# EasyEDA schematic SCH_v0.6_2021-07-22.json

## Sheets
1 CPU CORE: TITLE: CPU Core; REV: 0.5; Date: 2021-04-05; Sheet: 2/4; Drawn By: Renee; Company: The Buffee Project
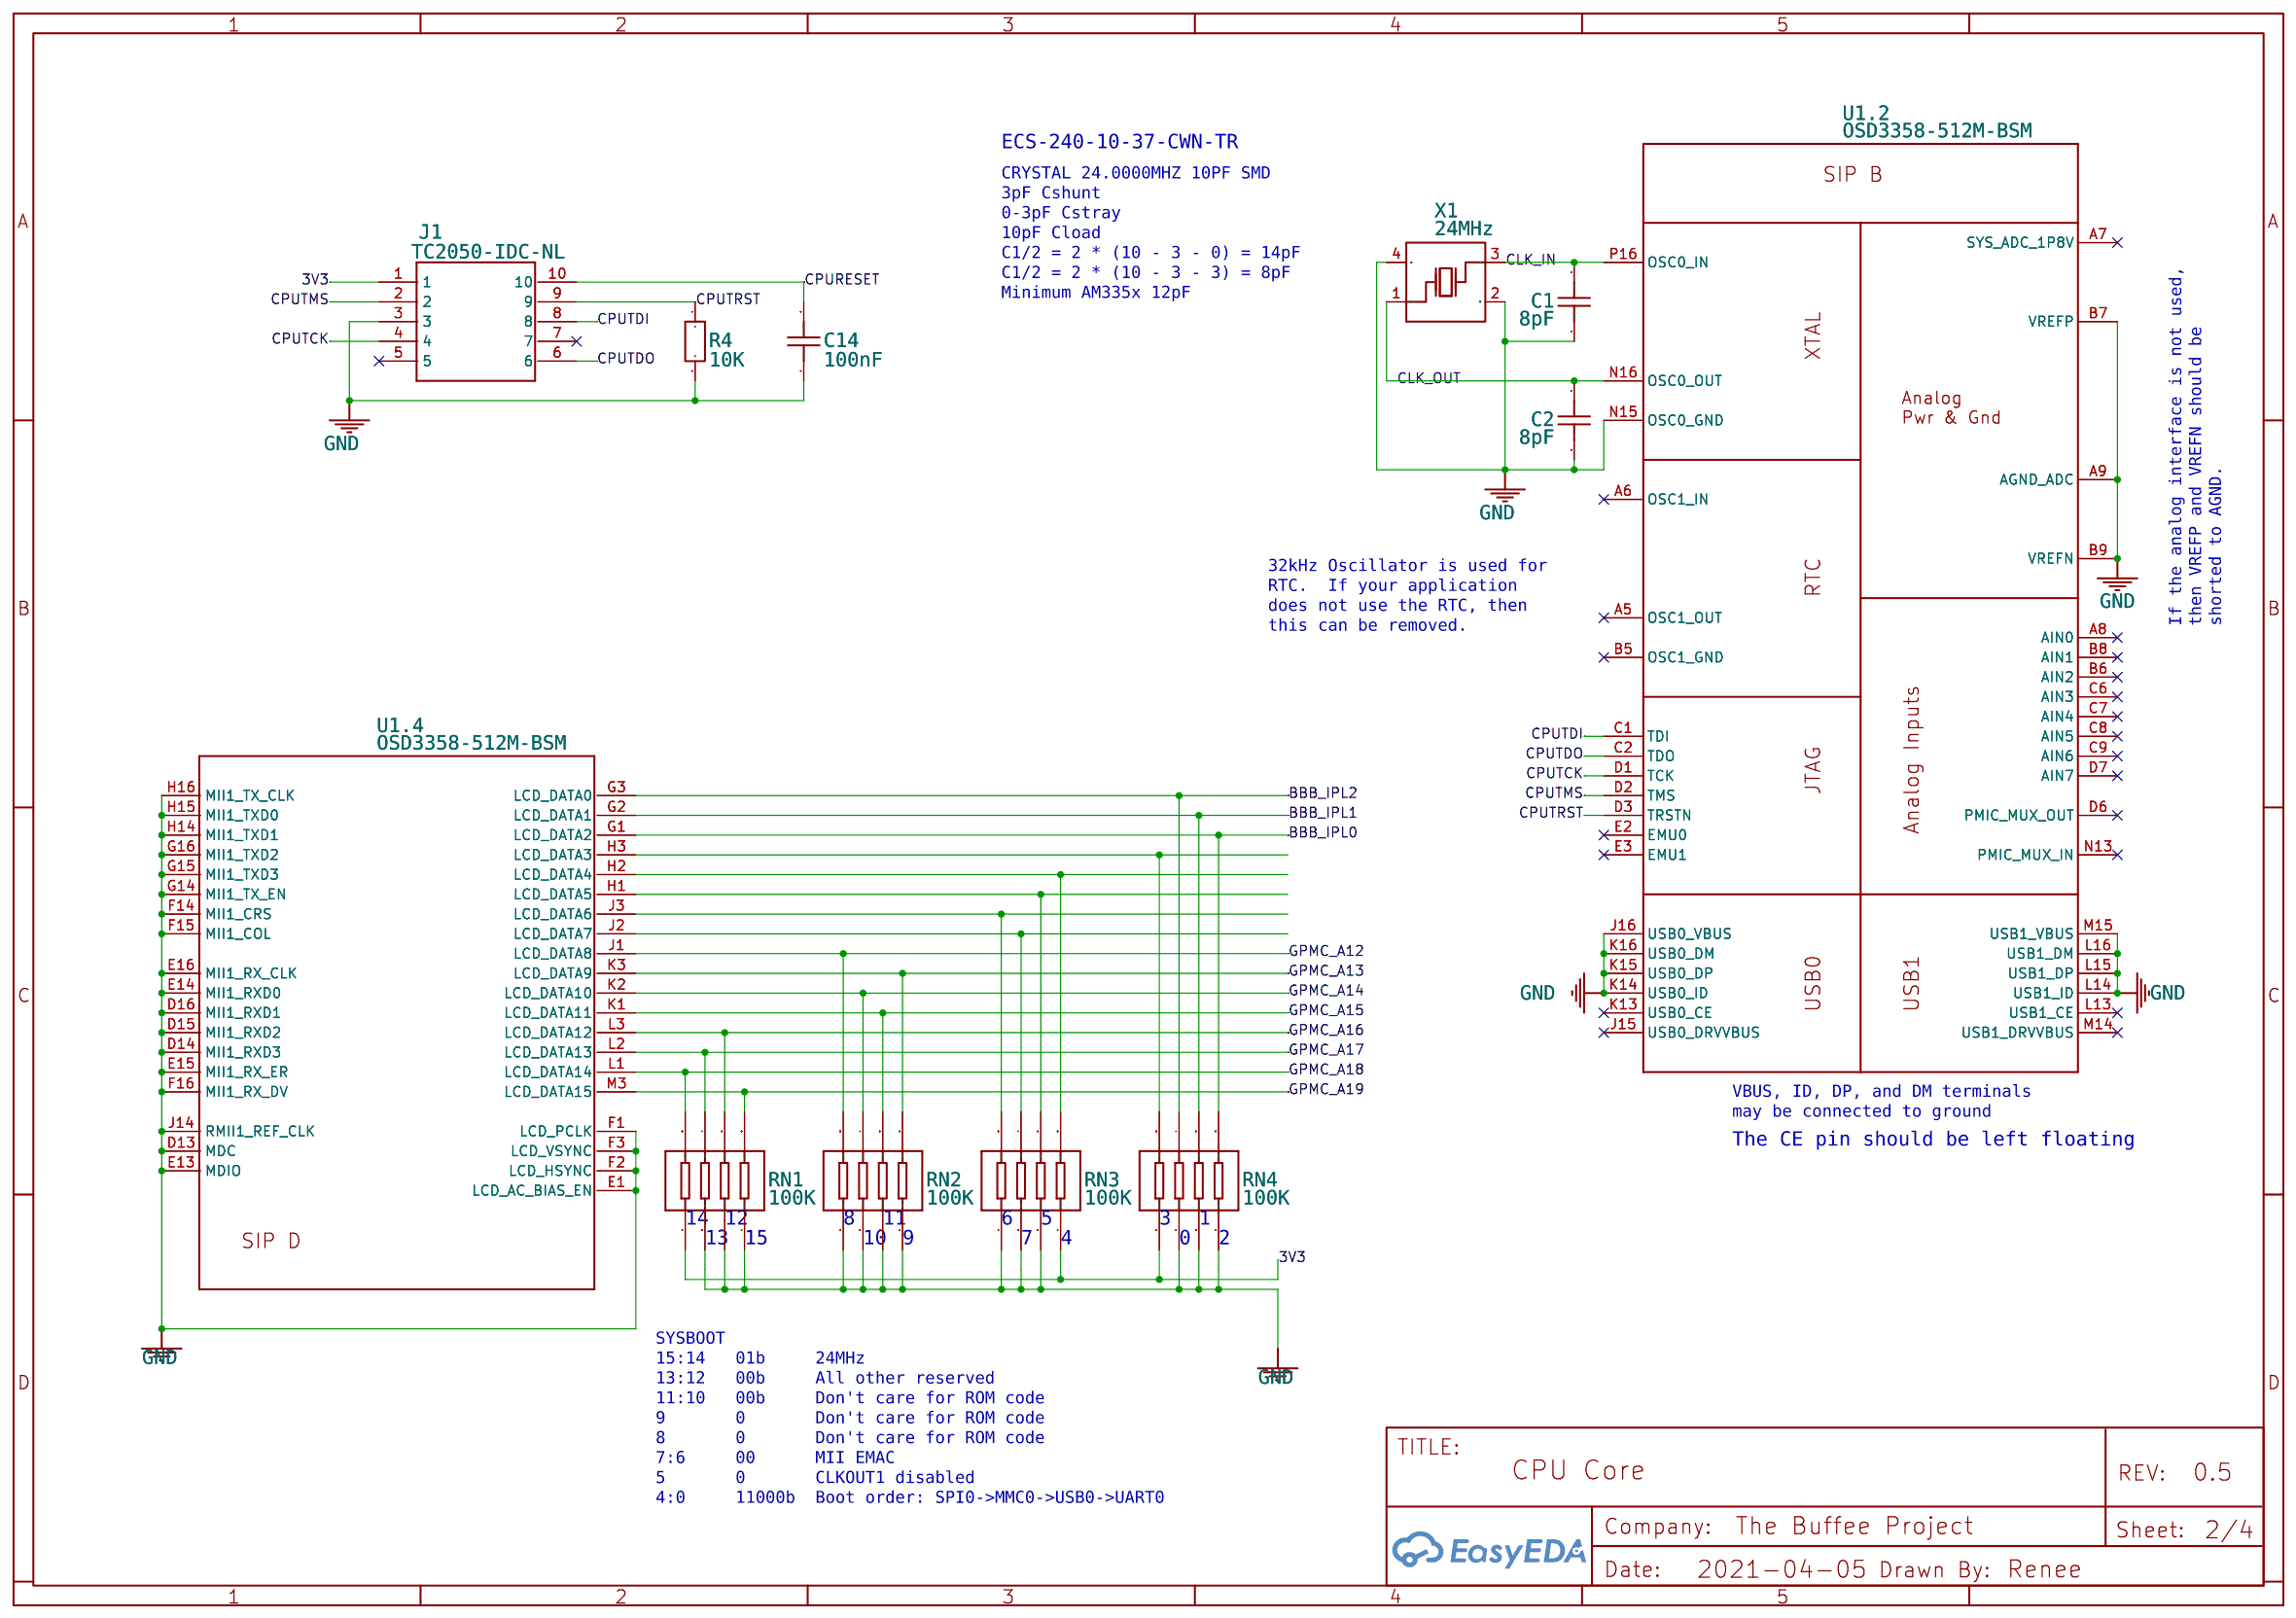
[diagram p0: CPU CORE]
2 CPU IO: TITLE: CPU Interface; Date: 2021-04-08; Sheet: 3/4
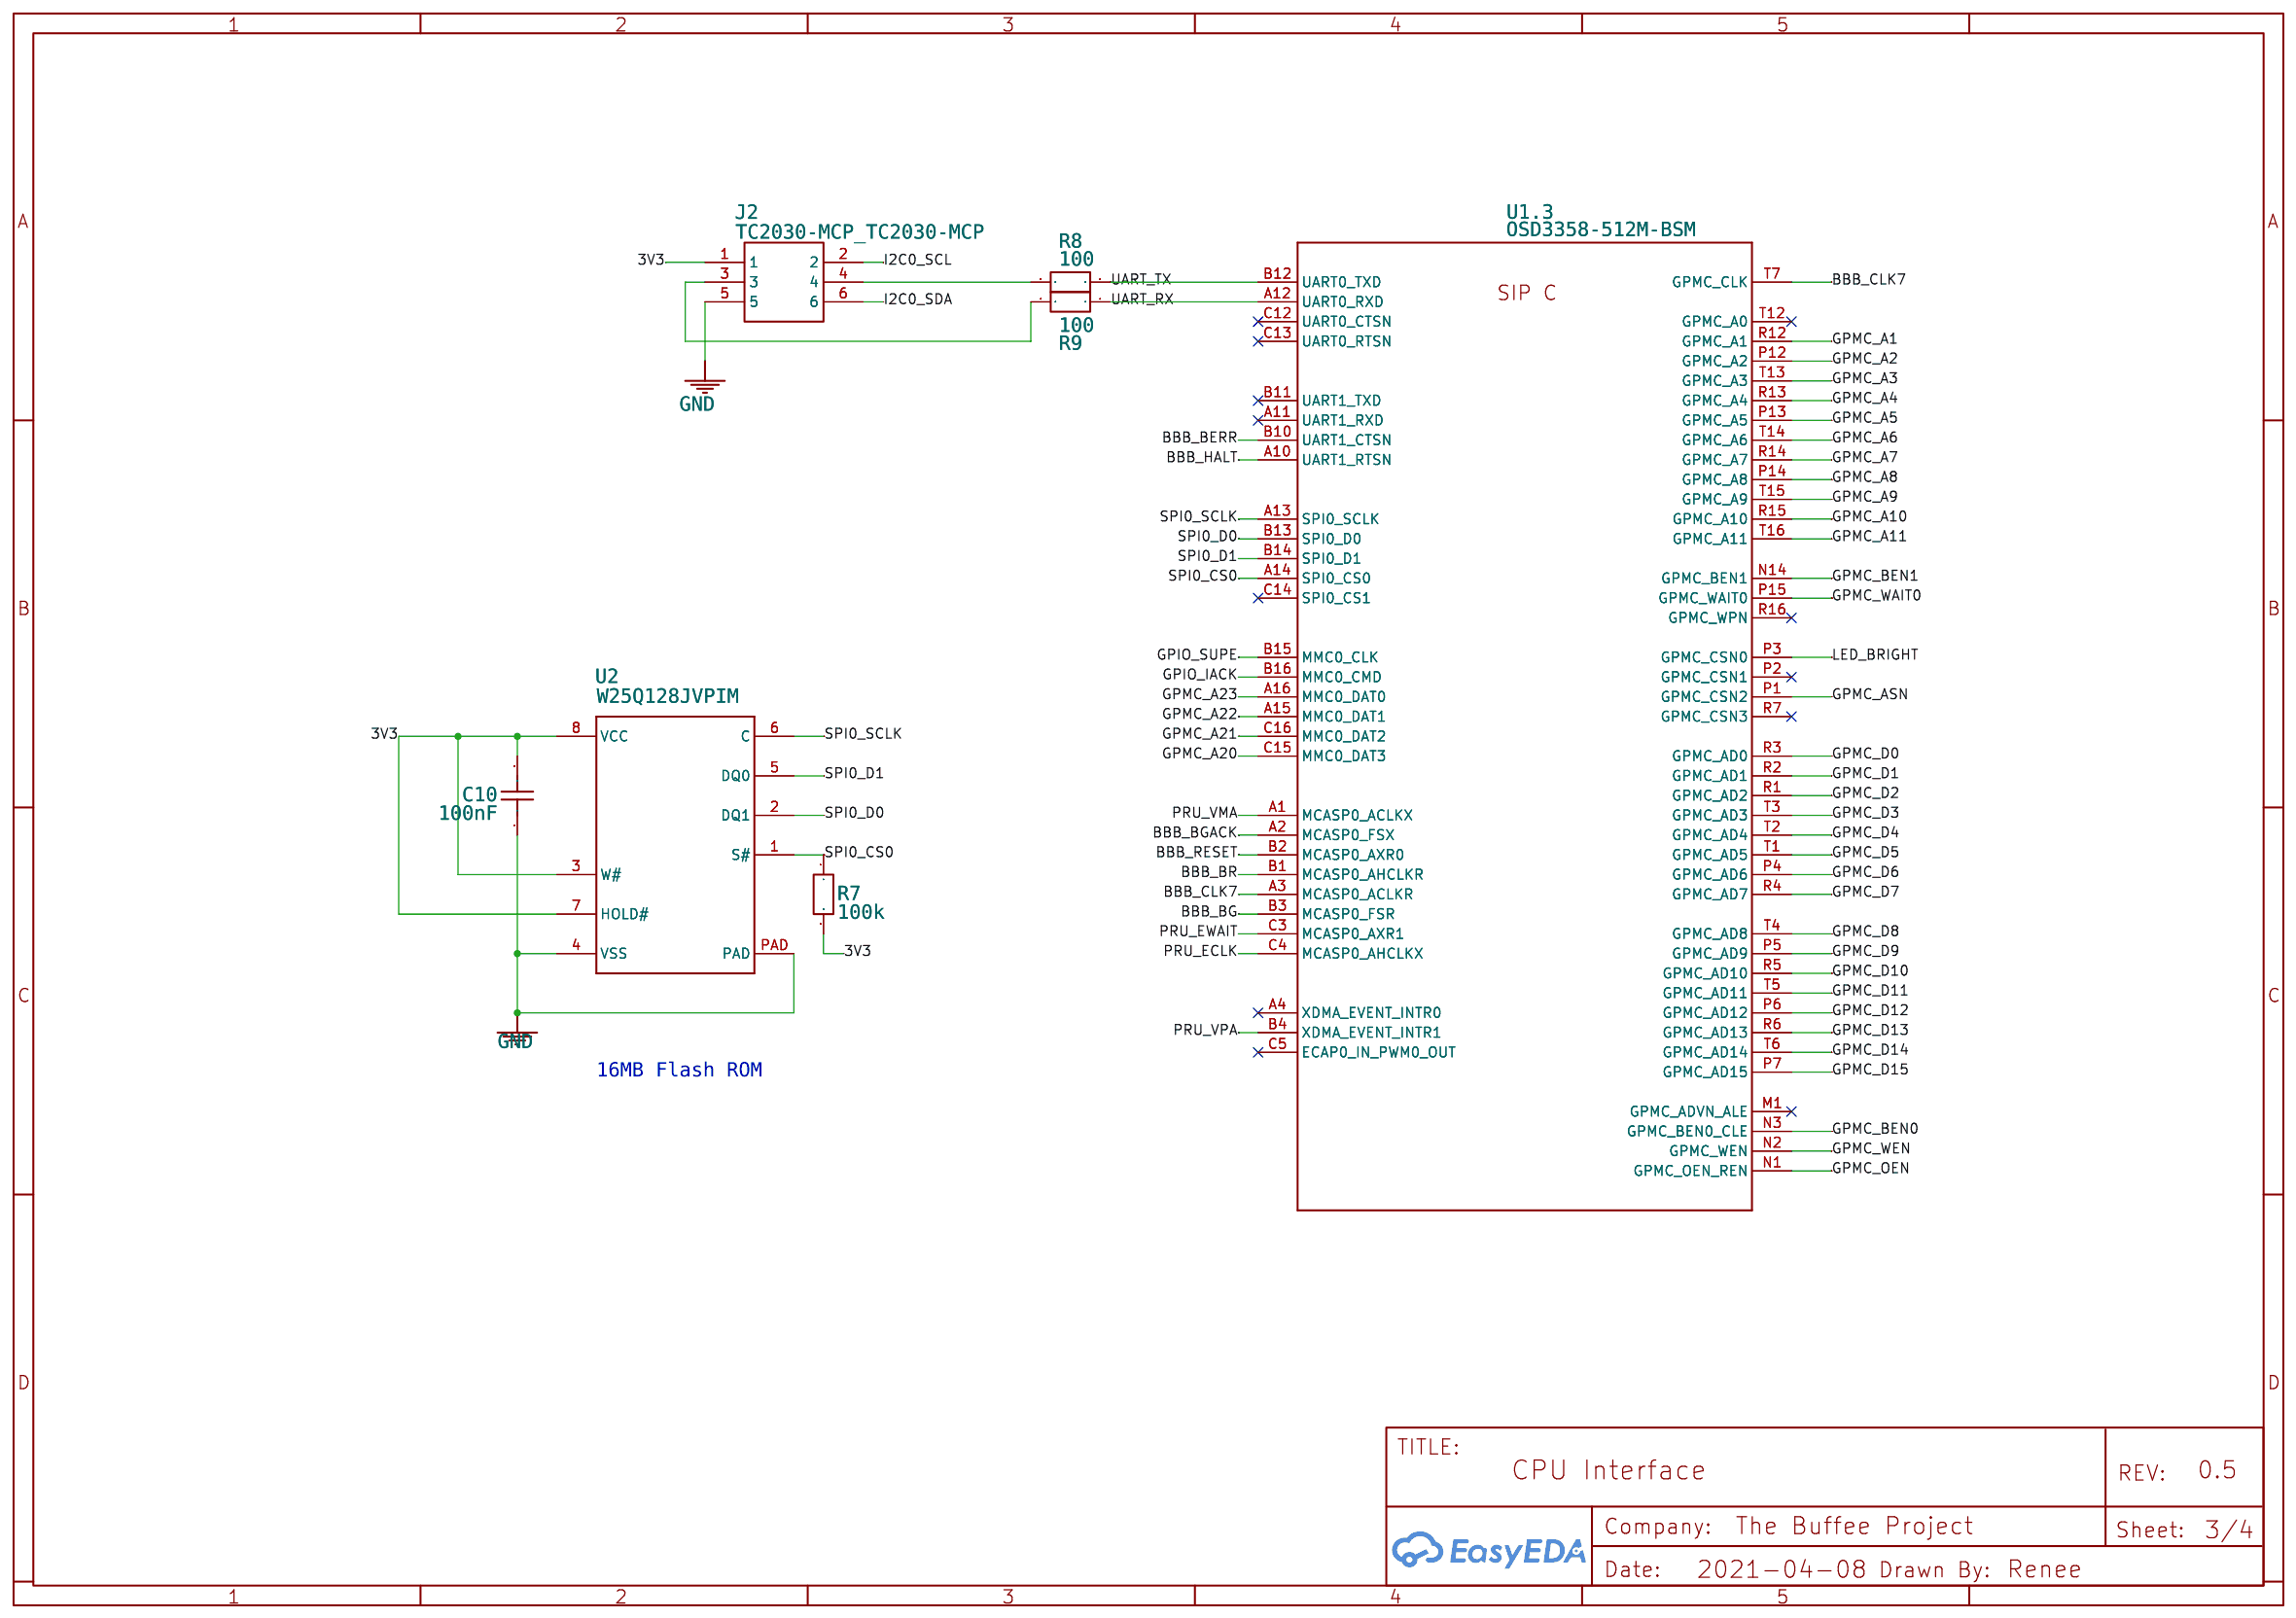
[diagram p1: CPU IO]
3 M68K IO: TITLE: M68K Interface; Date: 2021-04-08; Sheet: 4/4
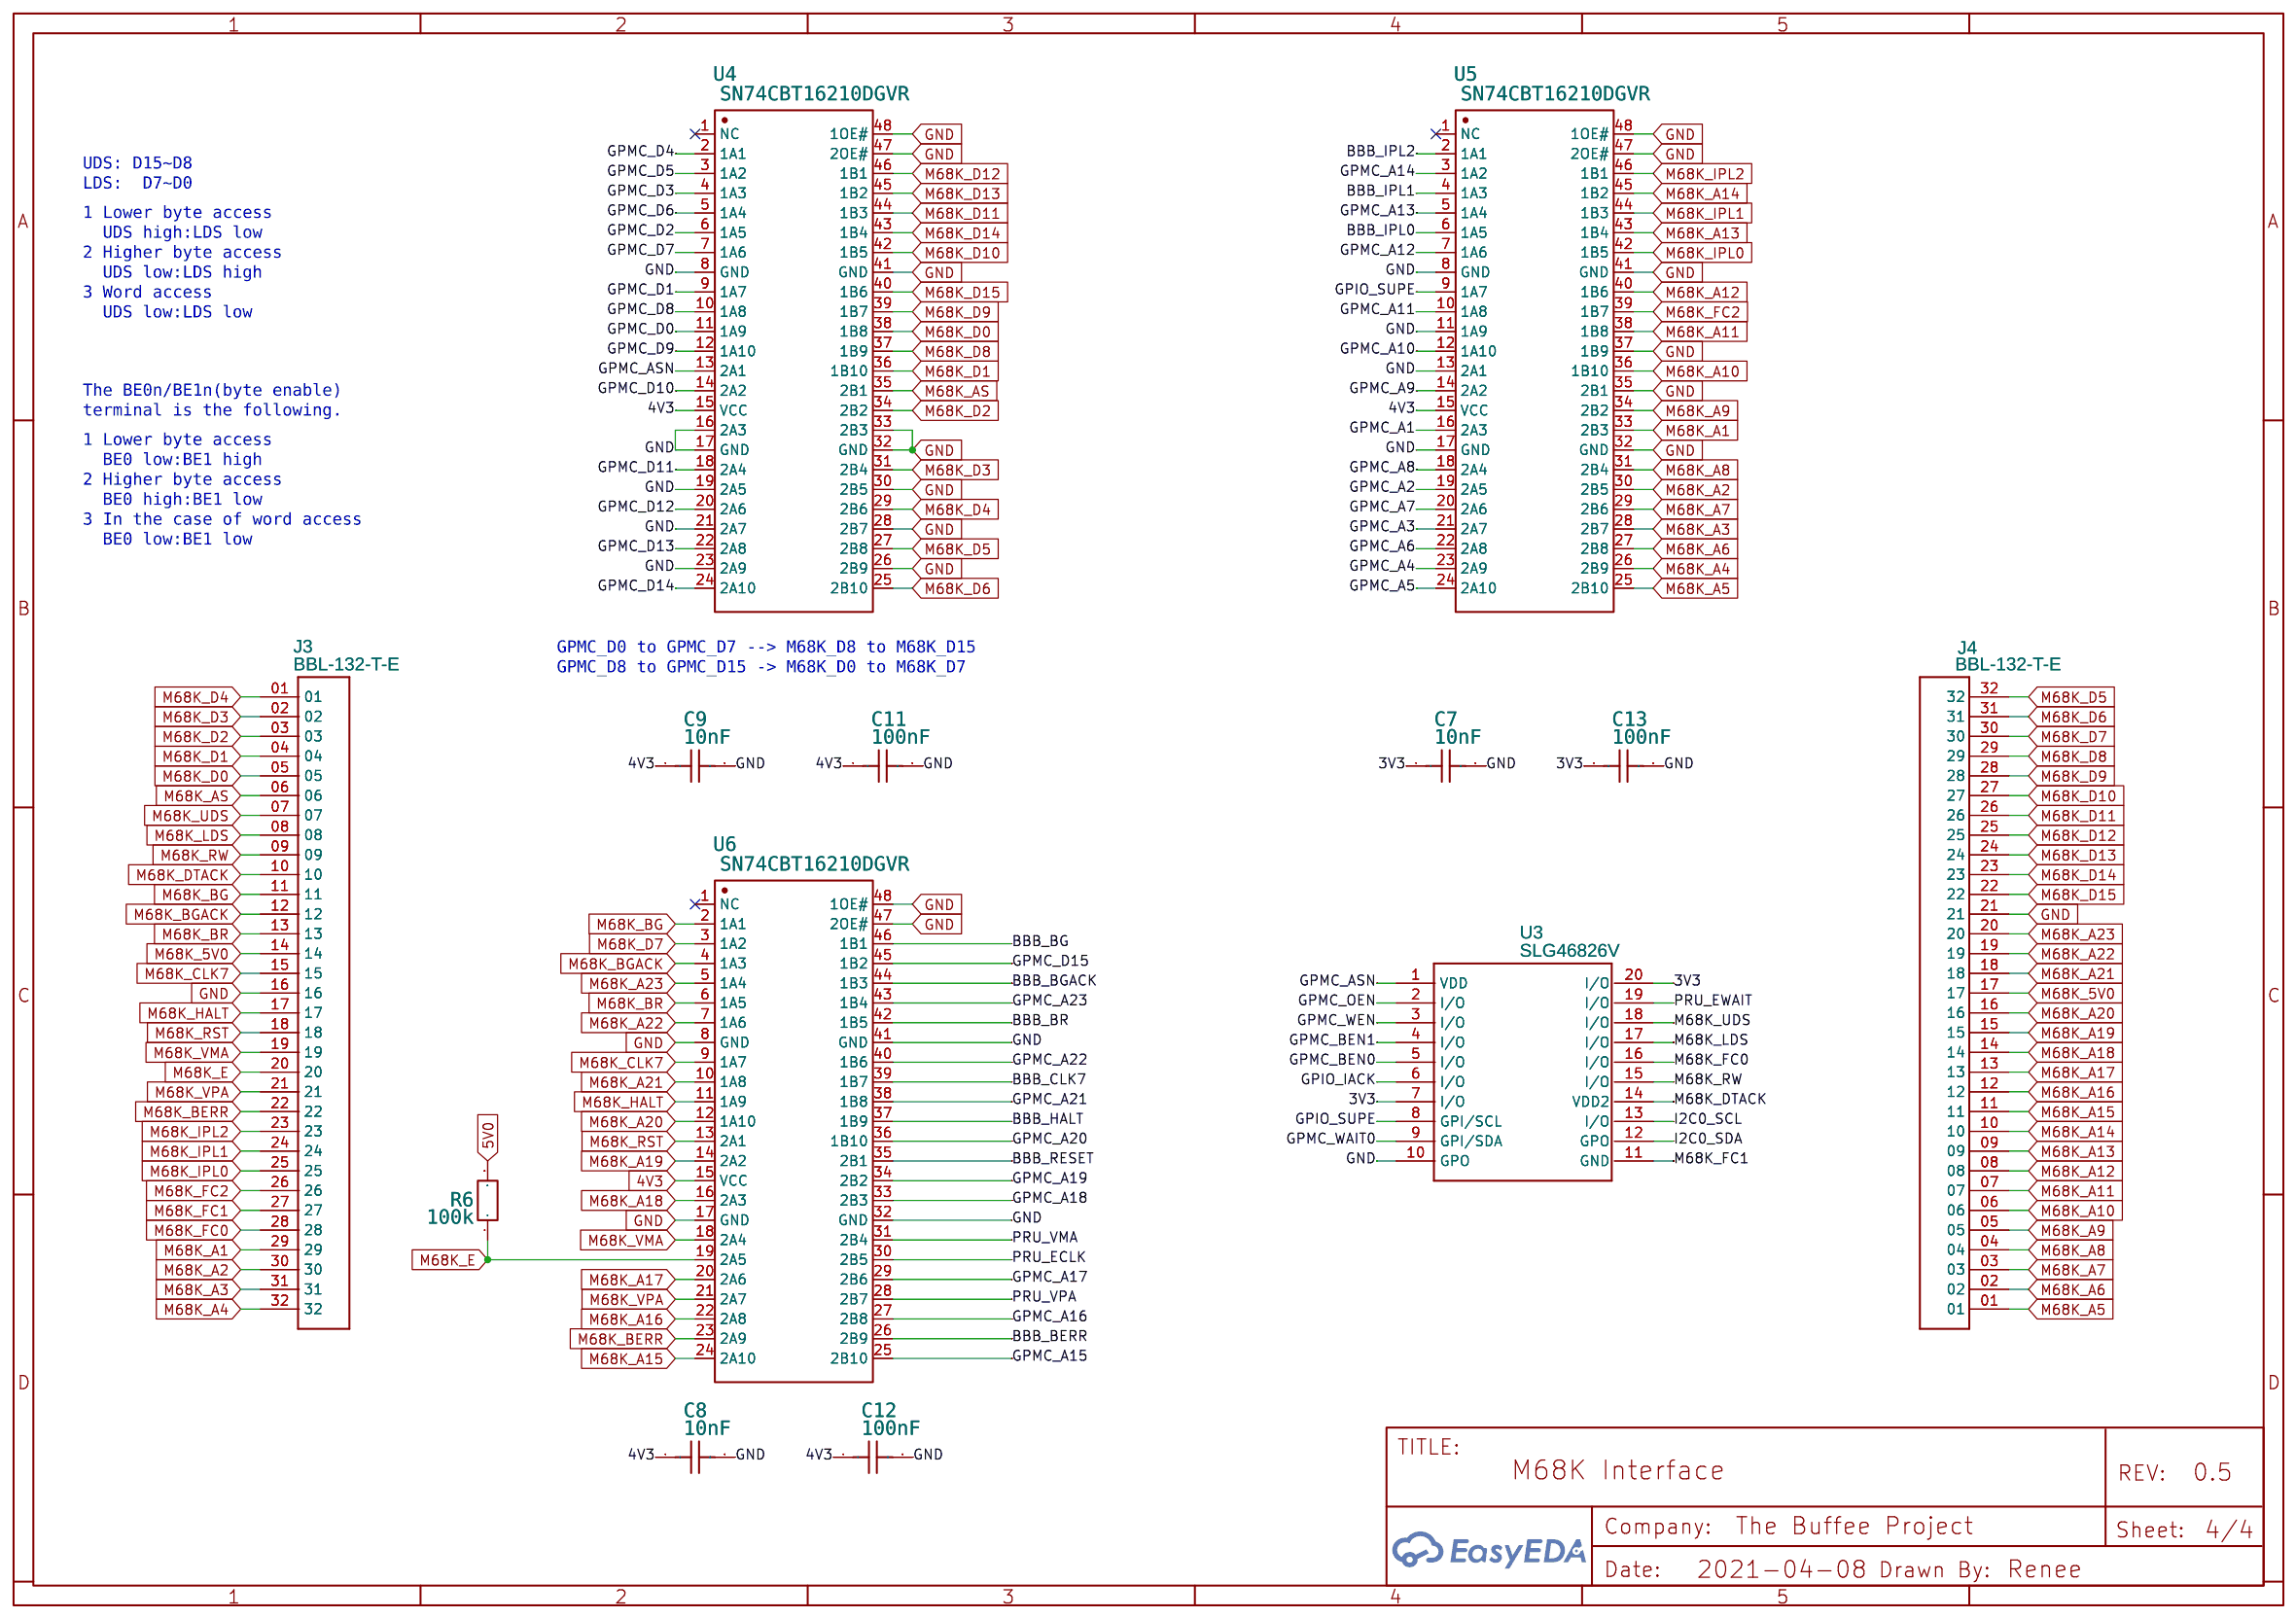
[diagram p2: M68K IO]
4 POWER: TITLE: CPU Power and LED; Date: 2021-04-08; Sheet: 1/4
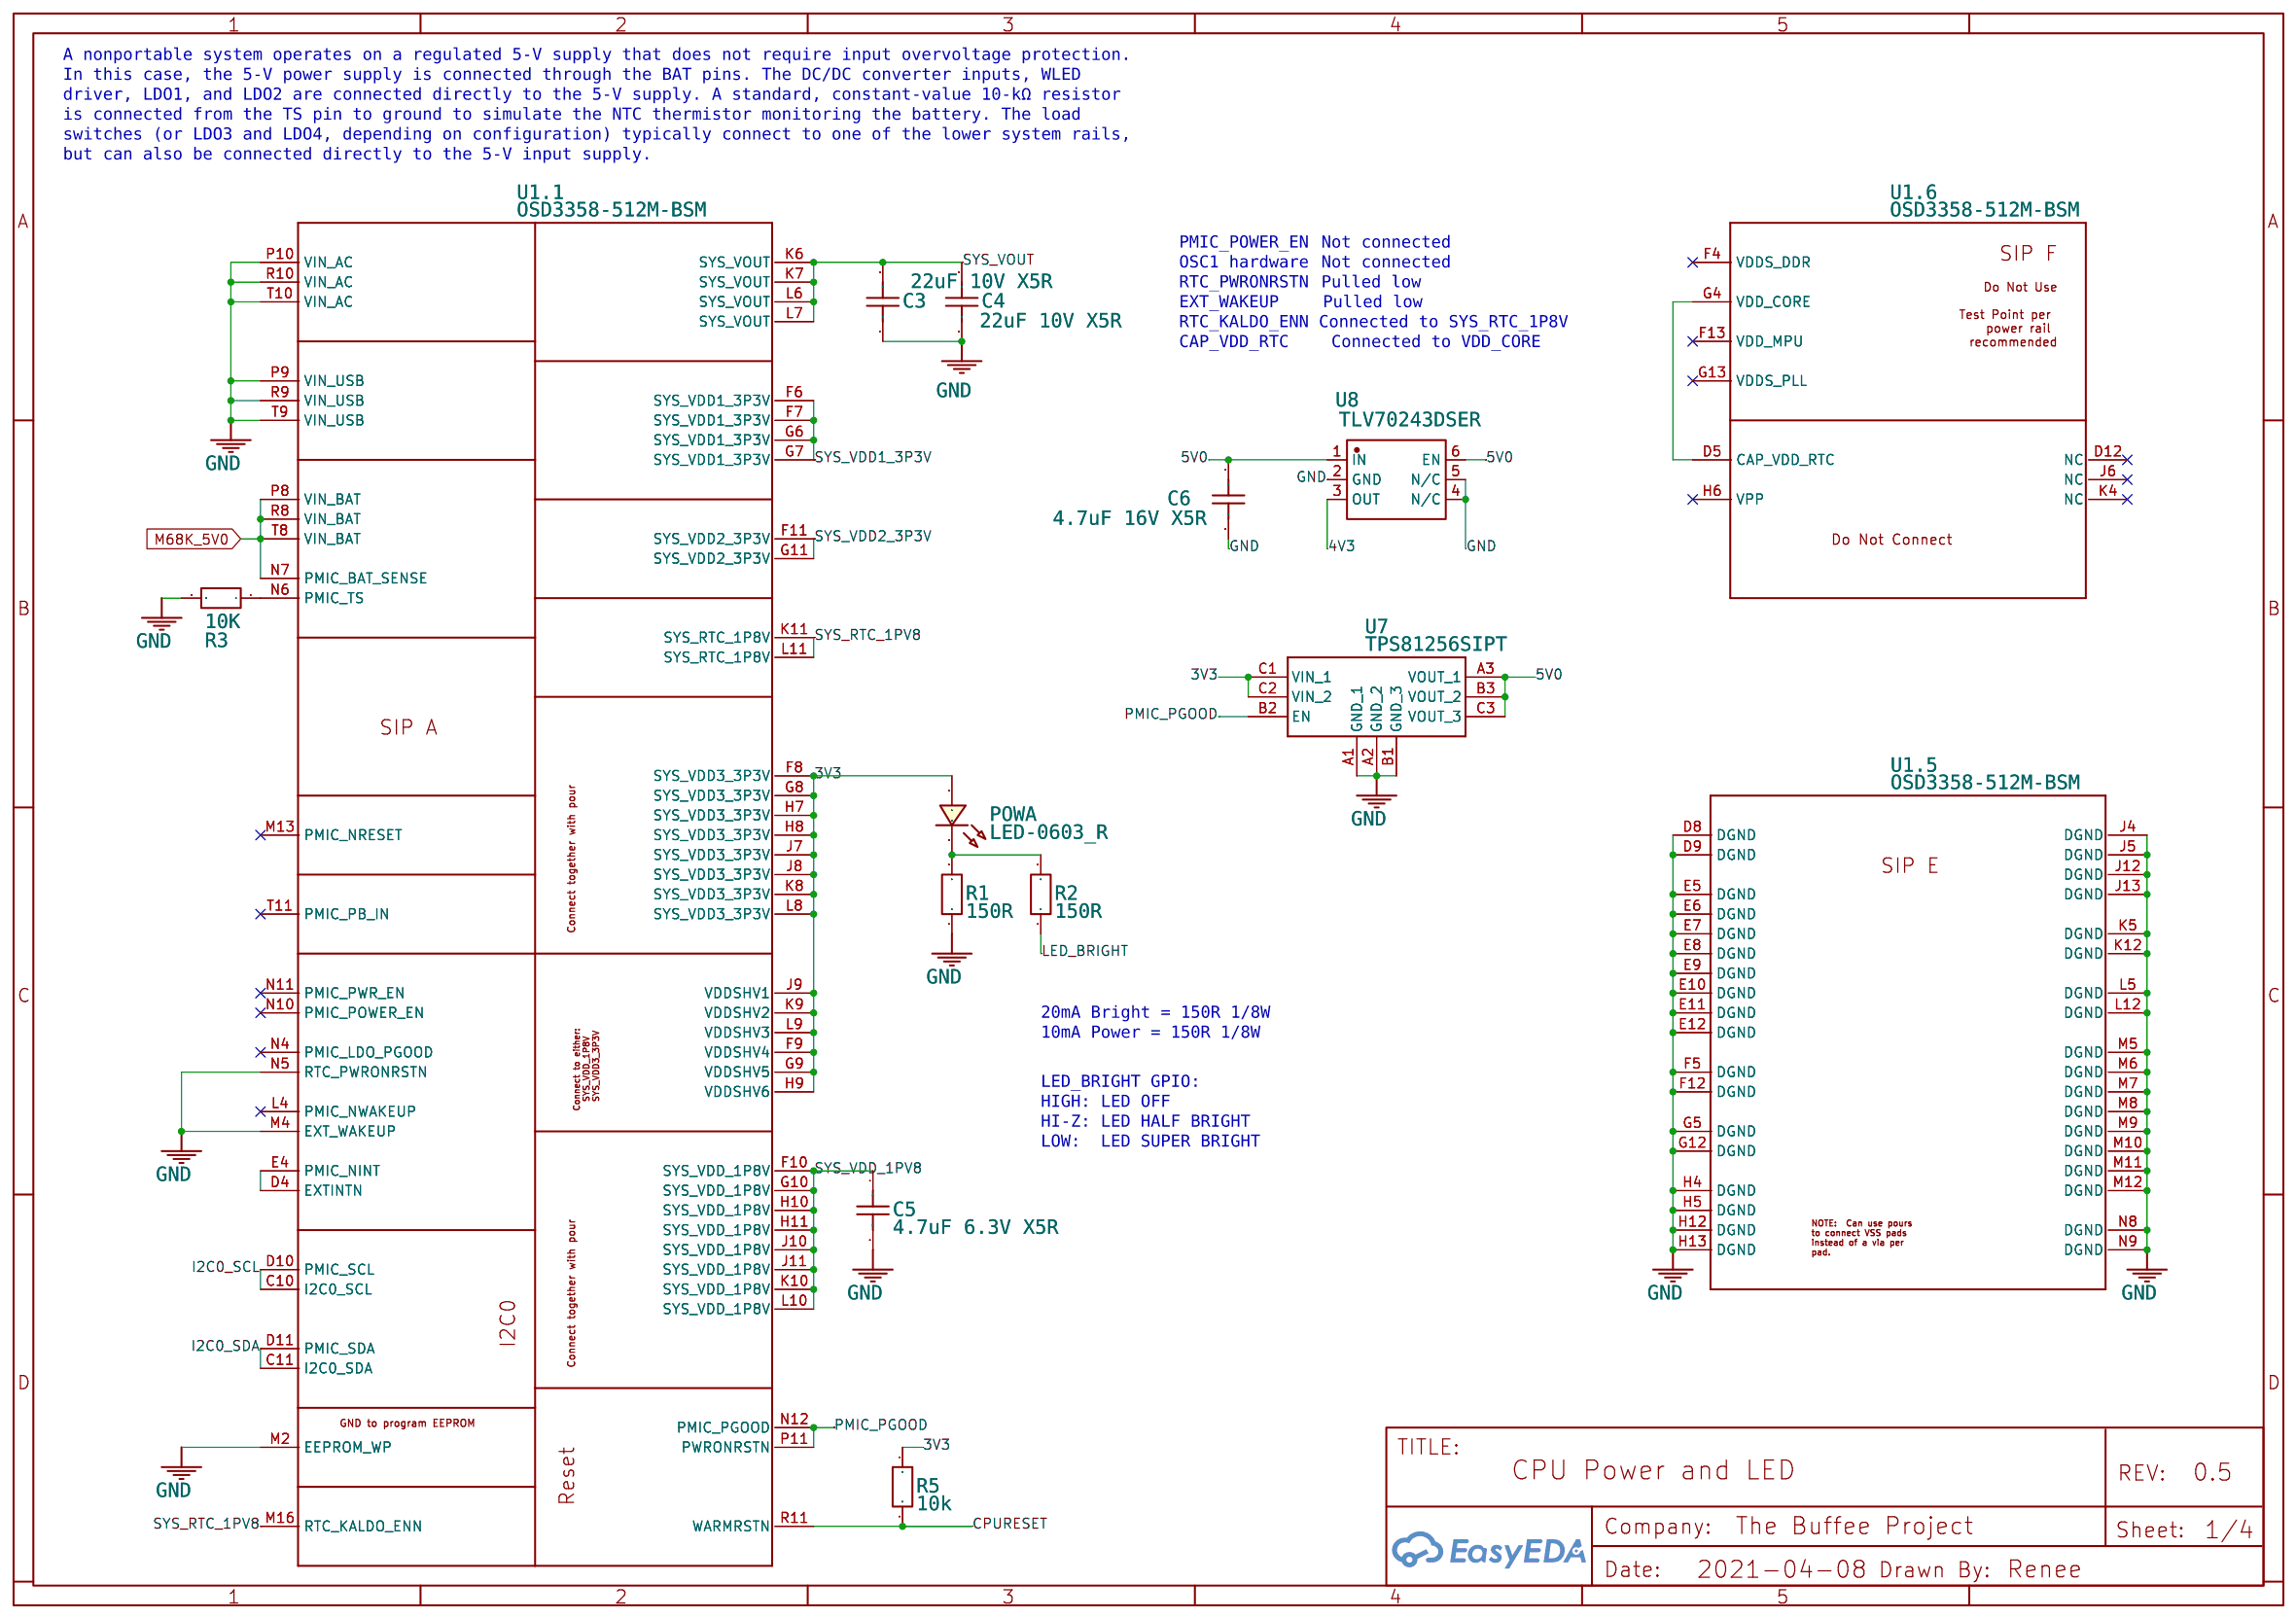
[diagram p3: POWER]

## Parts
sheet CPU CORE
C1  8pF  [0402]
C2  8pF  [0402]
C14  100nF  [0402]
J1  TC2050-IDC-NL  [TAG-CONNECT_TC2050-IDC-NL]
R4  10K  [0402]
RN1  100K  [RES-ARRAY-SMD_0402-8P-L2.0-W1.0-BL]
RN2  100K  [RES-ARRAY-SMD_0402-8P-L2.0-W1.0-BL]
RN3  100K  [RES-ARRAY-SMD_0402-8P-L2.0-W1.0-BL]
RN4  100K  [RES-ARRAY-SMD_0402-8P-L2.0-W1.0-BL]
X1  24MHz  [OSC-SMD_4P-L2.0-W1.6-BL]
sheet CPU IO
C10  100nF  [0402]
J2  TC2030-MCP_TC2030-MCP  [TAG-CONNECT_TC2030-IDC-NL]
R7  100k  [0402]
R8  100  [0402]
R9  100  [0402]
U2  W25Q128JVPIM  [W-PDFN-8]
sheet M68K IO
C7  10nF  [0402]
C8  10nF  [0402]
C9  10nF  [0402]
C11  100nF  [0402]
C12  100nF  [0402]
C13  100nF  [0402]
J3  BBL-132-T-E  [SAMTEC_BBL-132-T-E]
J4  BBL-132-T-E  [SAMTEC_BBL-132-T-E]
R6  100k  [0402]
U3  SLG46826V  [STQFN-20L-2.0X2.2-#4]
U4  SN74CBT16210DGVR  [TVSOP-48_L9.8-W4.5-P0.40-LS6.4-BL]
U5  SN74CBT16210DGVR  [TVSOP-48_L9.8-W4.5-P0.40-LS6.4-BL]
U6  SN74CBT16210DGVR  [TVSOP-48_L9.8-W4.5-P0.40-LS6.4-BL]
sheet POWER
C3  22uF 10V X5R  [C0603]
C4  22uF 10V X5R  [C0603]
C5  4.7uF 6.3V X5R  [0402]
C6  4.7uF 16V X5R  [0402]
POWA  LED-0603_R  [LED0603_RED]
R1  150R  [R0805]
R2  150R  [R0805]
R3  10K  [0402]
R5  10k  [0402]
U1  OSD3358-512M-BSM  [OSD335X-BGA-256]  (sections 1,2,3,4,5,6)
U7  TPS81256SIPT  [BGA9C100P3X3_292X258X100]
U8  TLV70243DSER  [WSON-6_L1.5-W1.5-P0.50-TL]

## Library data of the parts
C1 C2 = C_0201_US: Supplier Part: C307443; Supplier: LCSC; Contributor: LCEDA_Lib; Manufacturer Part: CC0402DRNPO9BN8R0; Manufacturer: YAGEO
C10-C14 = C_0402_US: Supplier Part: C1525; Supplier: LCSC; Contributor: LCEDA_Lib; Manufacturer Part: CC0402KRX7R7BB104; Manufacturer: YAGEO
J1 = TC2050-IDC-NL: Contributor: Joar Gjersund
R4 R6-R9 = R_0201_EU: Supplier Part: C25741; Supplier: LCSC; Contributor: LCEDA_Lib; Manufacturer Part: 0402WGF1003TCE; Manufacturer: UniOhm
RN1-RN4 = 4D02WGJ0104TCE: Supplier: LCSC; Manufacturer: UniOhm; Supplier Part: C25724; SMT Type: Extend; JLCPCB SMD: Yes; LCSC Assembly: Yes
X1 = ECS-240-10-37-CWN-TR: Supplier: LCSC; Supplier Part: C435198; Manufacturer: ECS; Contributor: LCSC
J2 = TC2030-MCP_TC2030-MCP: Contributor: Robert Chen
U2 = S25FL127S: Contributor: Renee; Manufacturer Part: S25FL127SABMFI103; Supplier: LCSC; Manufacturer: Cypress Semicon; Supplier Part: C511143
C7-C9 = C_0402_US: Supplier Part: C1525; Supplier: LCSC; Contributor: LCEDA_Lib; Manufacturer Part: CC0402KRX7R7BB103; Manufacturer: YAGEO
J3 J4 = BBL-132-T-E: Contributor: charlescarver; Manufacturer: Samtec; Supplier: Mouser; Supplier Part: 200-BBL132TE
U3 = SLG46826V: Contributor: delphin1305
U4-U6 = SN74CBT16210DLRG4: Supplier: LCSC; Manufacturer: TI; Package Display: No
C3 C4 = C_0805_US: Supplier Part: C16780; Supplier: LCSC; Contributor: LCEDA_Lib; Manufacturer Part: CC0603MRX5R6BB226; Manufacturer: YAGEO
C5 = C_0402_US: Supplier Part: C1525; Supplier: LCSC; Contributor: LCEDA_Lib; Manufacturer Part: CC0402KRX5R5BB475; Manufacturer: YAGEO
C6 = C_0402_US: Supplier Part: C1525; Supplier: LCSC; Contributor: LCEDA_Lib; Manufacturer Part: CC0402MRX5R7BB475; Manufacturer: YAGEO
POWA = LED-0603_R: Manufacturer: EVERLIGHT(台湾亿光); Manufacturer Part: 19-217/R6C-AL1M2VY/3T; Supplier Part: C72044; Supplier: LCSC; Contributor: LCEDA_01
R1-R3 = R_0402_EU: Contributor: LCEDA_Lib
R5 = R_0201_EU: Supplier Part: C98838; Supplier: LCSC; Contributor: LCEDA_Lib; Manufacturer Part: TC0225F1002TCE; Manufacturer: UniOhm
U1 = OSD3358-512M-BSM: Contributor: Renee; subpart_no: 1
U7 = TPS81256SIPT: Contributor: LFK84
U8 = TLV70243DSER

## Nets
3V3: C7.1 C10.2 C13.1 J1.1 J2.1 POWA.1 R5.1 R7.2 RN1.1 RN3.4 RN4.1 U1.F8(SYS_VDD3_3P3V) U1.F9(VDDSHV4) U1.G8(SYS_VDD3_3P3V) U1.G9(VDDSHV5) U1.H7(SYS_VDD3_3P3V) U1.H8(SYS_VDD3_3P3V) U1.H9(VDDSHV6) U1.J7(SYS_VDD3_3P3V) U1.J8(SYS_VDD3_3P3V) U1.J9(VDDSHV1) U1.K8(SYS_VDD3_3P3V) U1.K9(VDDSHV2) U1.L8(SYS_VDD3_3P3V) U1.L9(VDDSHV3) U2.3(W#) U2.7(HOLD#) U2.8(VCC) U3.7(I/O) U3.20(I/O) U7.C1(VIN_1) U7.C2(VIN_2)
4V3: C8.1 C9.1 C11.1 C12.1 U4.15(VCC) U5.15(VCC) U6.15(VCC) U8.3(OUT)
5V0: C6.1 R6.2 U7.A3(VOUT_1) U7.B3(VOUT_2) U7.C3(VOUT_3) U8.1(IN) U8.6(EN)
GND: C1.2 C2.2 C3.1 C4.1 C5.2 C6.2 C7.2 C8.2 C9.2 C10.1 C11.2 C12.2 C13.2 C14.1 J1.3 J2.5 J3.16 J4.21 R1.1 R3.2 R4.2 RN1.2 RN1.3 RN1.4 RN2.1 RN2.2 RN2.3 RN2.4 RN3.1 RN3.2 RN3.3 RN4.2 RN4.3 RN4.4 U1.A9(AGND_ADC) U1.B7(VREFP) U1.B9(VREFN) U1.D8(DGND) U1.D9(DGND) U1.D13(MDC) U1.D14(MII1_RXD3) U1.D15(MII1_RXD2) U1.D16(MII1_RXD1) U1.E1(LCD_AC_BIAS_EN) U1.E5(DGND) U1.E6(DGND) U1.E7(DGND) U1.E8(DGND) U1.E9(DGND) U1.E10(DGND) U1.E11(DGND) U1.E12(DGND) U1.E13(MDIO) U1.E14(MII1_RXD0) U1.E15(MII1_RX_ER) U1.E16(MII1_RX_CLK) U1.F1(LCD_PCLK) U1.F2(LCD_HSYNC) U1.F3(LCD_VSYNC) U1.F5(DGND) U1.F12(DGND) U1.F14(MII1_CRS) U1.F15(MII1_COL) U1.F16(MII1_RX_DV) U1.G5(DGND) U1.G12(DGND) U1.G14(MII1_TX_EN) U1.G15(MII1_TXD3) U1.G16(MII1_TXD2) U1.H4(DGND) U1.H5(DGND) U1.H12(DGND) U1.H13(DGND) U1.H14(MII1_TXD1) U1.H15(MII1_TXD0) U1.H16(MII1_TX_CLK) U1.J4(DGND) U1.J5(DGND) U1.J12(DGND) U1.J13(DGND) U1.J14(RMII1_REF_CLK) U1.J16(USB0_VBUS) U1.K5(DGND) U1.K12(DGND) U1.K14(USB0_ID) U1.K15(USB0_DP) U1.K16(USB0_DM) U1.L5(DGND) U1.L12(DGND) U1.L14(USB1_ID) U1.L15(USB1_DP) U1.L16(USB1_DM) U1.M2(EEPROM_WP) U1.M4(EXT_WAKEUP) U1.M5(DGND) U1.M6(DGND) U1.M7(DGND) U1.M8(DGND) U1.M9(DGND) U1.M10(DGND) U1.M11(DGND) U1.M12(DGND) U1.M15(USB1_VBUS) U1.N5(RTC_PWRONRSTN) U1.N8(DGND) U1.N9(DGND) U1.N15(OSC0_GND) U1.P9(VIN_USB) U1.P10(VIN_AC) U1.R9(VIN_USB) U1.R10(VIN_AC) U1.T9(VIN_USB) U1.T10(VIN_AC) U2.4(VSS) U2.PAD U3.10(GPO) U4.8(GND) U4.16(2A3) U4.17(GND) U4.19(2A5) U4.21(2A7) U4.23(2A9) U4.26(2B9) U4.28(2B7) U4.30(2B5) U4.32(GND) U4.33(2B3) U4.41(GND) U4.47(2OE#) U4.48(1OE#) U5.8(GND) U5.11(1A9) U5.13(2A1) U5.17(GND) U5.32(GND) U5.35(2B1) U5.37(1B9) U5.41(GND) U5.47(2OE#) U5.48(1OE#) U6.8(GND) U6.17(GND) U6.32(GND) U6.41(GND) U6.47(2OE#) U6.48(1OE#) U7.A1(GND_1) U7.A2(GND_2) U7.B1(GND_3) U8.2(GND) U8.4(N/C) U8.5(N/C) X1.2(GND) X1.4(GND)
BBB_BERR: U1.B10(UART1_CTSN) U6.26(2B9)
BBB_BG: U1.B3(MCASP0_FSR) U6.46(1B1)
BBB_BGACK: U1.A2(MCASP0_FSX) U6.44(1B3)
BBB_BR: U1.B1(MCASP0_AHCLKR) U6.42(1B5)
BBB_CLK7: U1.A3(MCASP0_ACLKR) U1.T7(GPMC_CLK) U6.39(1B7)
BBB_HALT: U1.A10(UART1_RTSN) U6.37(1B9)
BBB_IPL0: RN4.5 U1.G1(LCD_DATA2) U5.6(1A5)
BBB_IPL1: RN4.6 U1.G2(LCD_DATA1) U5.4(1A3)
BBB_IPL2: RN4.7 U1.G3(LCD_DATA0) U5.2(1A1)
BBB_RESET: U1.B2(MCASP0_AXR0) U6.35(2B1)
CLK_IN: C1.1 U1.P16(OSC0_IN) X1.3(OSC2)
CLK_OUT: C2.1 U1.N16(OSC0_OUT) X1.1(OSC1)
CPURESET: C14.2 J1.10 R5.2 U1.R11(WARMRSTN)
CPUTCK: J1.4 U1.D1(TCK)
CPUTDI: J1.8 U1.C1(TDI)
CPUTDO: J1.6 U1.C2(TDO)
CPUTMS: J1.2 U1.D2(TMS)
CPUTRST: J1.9 R4.1 U1.D3(TRSTN)
GPIO_IACK: U1.B16(MMC0_CMD) U3.6(I/O)
GPIO_SUPE: U1.B15(MMC0_CLK) U3.8(GPI/SCL) U5.9(1A7)
GPMC_A1: U1.R12(GPMC_A1) U5.16(2A3)
GPMC_A2: U1.P12(GPMC_A2) U5.19(2A5)
GPMC_A3: U1.T13(GPMC_A3) U5.21(2A7)
GPMC_A4: U1.R13(GPMC_A4) U5.23(2A9)
GPMC_A5: U1.P13(GPMC_A5) U5.24(2A10)
GPMC_A6: U1.T14(GPMC_A6) U5.22(2A8)
GPMC_A7: U1.R14(GPMC_A7) U5.20(2A6)
GPMC_A8: U1.P14(GPMC_A8) U5.18(2A4)
GPMC_A9: U1.T15(GPMC_A9) U5.14(2A2)
GPMC_A10: U1.R15(GPMC_A10) U5.12(1A10)
GPMC_A11: U1.T16(GPMC_A11) U5.10(1A8)
GPMC_A12: RN2.8 U1.J1(LCD_DATA8) U5.7(1A6)
GPMC_A13: RN2.5 U1.K3(LCD_DATA9) U5.5(1A4)
GPMC_A14: RN2.7 U1.K2(LCD_DATA10) U5.3(1A2)
GPMC_A15: RN2.6 U1.K1(LCD_DATA11) U6.25(2B10)
GPMC_A16: RN1.6 U1.L3(LCD_DATA12) U6.27(2B8)
GPMC_A17: RN1.7 U1.L2(LCD_DATA13) U6.29(2B6)
GPMC_A18: RN1.8 U1.L1(LCD_DATA14) U6.33(2B3)
GPMC_A19: RN1.5 U1.M3(LCD_DATA15) U6.34(2B2)
GPMC_A20: U1.C15(MMC0_DAT3) U6.36(1B10)
GPMC_A21: U1.C16(MMC0_DAT2) U6.38(1B8)
GPMC_A22: U1.A15(MMC0_DAT1) U6.40(1B6)
GPMC_A23: U1.A16(MMC0_DAT0) U6.43(1B4)
GPMC_ASN: U1.P1(GPMC_CSN2) U3.1(VDD) U4.13(2A1)
GPMC_BEN0: U1.N3(GPMC_BEN0_CLE) U3.5(I/O)
GPMC_BEN1: U1.N14(GPMC_BEN1) U3.4(I/O)
GPMC_D0: U1.R3(GPMC_AD0) U4.11(1A9)
GPMC_D1: U1.R2(GPMC_AD1) U4.9(1A7)
GPMC_D2: U1.R1(GPMC_AD2) U4.6(1A5)
GPMC_D3: U1.T3(GPMC_AD3) U4.4(1A3)
GPMC_D4: U1.T2(GPMC_AD4) U4.2(1A1)
GPMC_D5: U1.T1(GPMC_AD5) U4.3(1A2)
GPMC_D6: U1.P4(GPMC_AD6) U4.5(1A4)
GPMC_D7: U1.R4(GPMC_AD7) U4.7(1A6)
GPMC_D8: U1.T4(GPMC_AD8) U4.10(1A8)
GPMC_D9: U1.P5(GPMC_AD9) U4.12(1A10)
GPMC_D10: U1.R5(GPMC_AD10) U4.14(2A2)
GPMC_D11: U1.T5(GPMC_AD11) U4.18(2A4)
GPMC_D12: U1.P6(GPMC_AD12) U4.20(2A6)
GPMC_D13: U1.R6(GPMC_AD13) U4.22(2A8)
GPMC_D14: U1.T6(GPMC_AD14) U4.24(2A10)
GPMC_D15: U1.P7(GPMC_AD15) U6.45(1B2)
GPMC_OEN: U1.N1(GPMC_OEN_REN) U3.2(I/O)
GPMC_WAIT0: U1.P15(GPMC_WAIT0) U3.9(GPI/SDA)
GPMC_WEN: U1.N2(GPMC_WEN) U3.3(I/O)
I2C0_SCL: J2.2 U1.C10(I2C0_SCL) U1.D10(PMIC_SCL) U3.13(I/O)
I2C0_SDA: J2.6 U1.C11(I2C0_SDA) U1.D11(PMIC_SDA) U3.12(GPO)
LED_BRIGHT: R2.1 U1.P3(GPMC_CSN0)
M68K_5V0: J3.14 J4.17 U1.N7(PMIC_BAT_SENSE) U1.P8(VIN_BAT) U1.R8(VIN_BAT) U1.T8(VIN_BAT)
M68K_A1: J3.29 U5.33(2B3)
M68K_A2: J3.30 U5.30(2B5)
M68K_A3: J3.31 U5.28(2B7)
M68K_A4: J3.32 U5.26(2B9)
M68K_A5: J4.01 U5.25(2B10)
M68K_A6: J4.02 U5.27(2B8)
M68K_A7: J4.03 U5.29(2B6)
M68K_A8: J4.04 U5.31(2B4)
M68K_A9: J4.05 U5.34(2B2)
M68K_A10: J4.06 U5.36(1B10)
M68K_A11: J4.07 U5.38(1B8)
M68K_A12: J4.08 U5.40(1B6)
M68K_A13: J4.09 U5.43(1B4)
M68K_A14: J4.10 U5.45(1B2)
M68K_A15: J4.11 U6.24(2A10)
M68K_A16: J4.12 U6.22(2A8)
M68K_A17: J4.13 U6.20(2A6)
M68K_A18: J4.14 U6.16(2A3)
M68K_A19: J4.15 U6.14(2A2)
M68K_A20: J4.16 U6.12(1A10)
M68K_A21: J4.18 U6.10(1A8)
M68K_A22: J4.19 U6.7(1A6)
M68K_A23: J4.20 U6.5(1A4)
M68K_AS: J3.06 U4.35(2B1)
M68K_BERR: J3.22 U6.23(2A9)
M68K_BG: J3.11 U6.2(1A1)
M68K_BGACK: J3.12 U6.4(1A3)
M68K_BR: J3.13 U6.6(1A5)
M68K_CLK7: J3.15 U6.9(1A7)
M68K_D0: J3.05 U4.38(1B8)
M68K_D1: J3.04 U4.36(1B10)
M68K_D2: J3.03 U4.34(2B2)
M68K_D3: J3.02 U4.31(2B4)
M68K_D4: J3.01 U4.29(2B6)
M68K_D5: J4.32 U4.27(2B8)
M68K_D6: J4.31 U4.25(2B10)
M68K_D7: J4.30 U6.3(1A2)
M68K_D8: J4.29 U4.37(1B9)
M68K_D9: J4.28 U4.39(1B7)
M68K_D10: J4.27 U4.42(1B5)
M68K_D11: J4.26 U4.44(1B3)
M68K_D12: J4.25 U4.46(1B1)
M68K_D13: J4.24 U4.45(1B2)
M68K_D14: J4.23 U4.43(1B4)
M68K_D15: J4.22 U4.40(1B6)
M68K_DTACK: J3.10 U3.14(VDD2)
M68K_E: J3.20 R6.1 U6.19(2A5)
M68K_FC0: J3.28 U3.16(I/O)
M68K_FC1: J3.27 U3.11(GND)
M68K_FC2: J3.26 U5.39(1B7)
M68K_HALT: J3.17 U6.11(1A9)
M68K_IPL0: J3.25 U5.42(1B5)
M68K_IPL1: J3.24 U5.44(1B3)
M68K_IPL2: J3.23 U5.46(1B1)
M68K_LDS: J3.08 U3.17(I/O)
M68K_RST: J3.18 U6.13(2A1)
M68K_RW: J3.09 U3.15(I/O)
M68K_UDS: J3.07 U3.18(I/O)
M68K_VMA: J3.19 U6.18(2A4)
M68K_VPA: J3.21 U6.21(2A7)
PMIC_PGOOD: U1.N12(PMIC_PGOOD) U1.P11(PWRONRSTN) U7.B2(EN)
PRU_ECLK: U1.C4(MCASP0_AHCLKX) U6.30(2B5)
PRU_EWAIT: U1.C3(MCASP0_AXR1) U3.19(I/O)
PRU_VMA: U1.A1(MCASP0_ACLKX) U6.31(2B4)
PRU_VPA: U1.B4(XDMA_EVENT_INTR1) U6.28(2B7)
SPI0_CS0: R7.1 U1.A14(SPI0_CS0) U2.1(S#)
SPI0_D0: U1.B13(SPI0_D0) U2.2(DQ1)
SPI0_D1: U1.B14(SPI0_D1) U2.5(DQ0)
SPI0_SCLK: U1.A13(SPI0_SCLK) U2.6(C)
SYS_RTC_1PV8: U1.K11(SYS_RTC_1P8V) U1.L11(SYS_RTC_1P8V) U1.M16(RTC_KALDO_ENN)
SYS_VDD1_3P3V: U1.F6(SYS_VDD1_3P3V) U1.F7(SYS_VDD1_3P3V) U1.G6(SYS_VDD1_3P3V) U1.G7(SYS_VDD1_3P3V)
SYS_VDD2_3P3V: U1.F11(SYS_VDD2_3P3V) U1.G11(SYS_VDD2_3P3V)
SYS_VDD_1PV8: C5.1 U1.F10(SYS_VDD_1P8V) U1.G10(SYS_VDD_1P8V) U1.H10(SYS_VDD_1P8V) U1.H11(SYS_VDD_1P8V) U1.J10(SYS_VDD_1P8V) U1.J11(SYS_VDD_1P8V) U1.K10(SYS_VDD_1P8V) U1.L10(SYS_VDD_1P8V)
SYS_VOUT: C3.2 C4.2 U1.K6(SYS_VOUT) U1.K7(SYS_VOUT) U1.L6(SYS_VOUT) U1.L7(SYS_VOUT)
UART_RX: R9.1 U1.A12(UART0_RXD)
UART_TX: R8.1 U1.B12(UART0_TXD)
Net-(J2-3): J2.3 R9.2
Net-(J2-4): J2.4 R8.2
Net-(POWA-2): POWA.2 R1.2 R2.2
Net-(R3-1): R3.1 U1.N6(PMIC_TS)
Net-(RN3-5): RN3.5 U1.H2(LCD_DATA4)
Net-(RN3-6): RN3.6 U1.H1(LCD_DATA5)
Net-(RN3-7): RN3.7 U1.J2(LCD_DATA7)
Net-(RN3-8): RN3.8 U1.J3(LCD_DATA6)
Net-(RN4-8): RN4.8 U1.H3(LCD_DATA3)
Net-(U1.1-D4): U1.D4(EXTINTN) U1.E4(PMIC_NINT)
Net-(U1.6-D5): U1.D5(CAP_VDD_RTC) U1.G4(VDD_CORE)

Not connected (* = marked no-connect by the designer): J1 5* 7*; U1 A4(XDMA_EVENT_INTR0)* A5(OSC1_OUT)* A6(OSC1_IN)* A7(SYS_ADC_1P8V)* A8(AIN0)* A11(UART1_RXD)* B5(OSC1_GND)* B6(AIN2)* B8(AIN1)* B11(UART1_TXD)* C5(ECAP0_IN_PWM0_OUT)* C6(AIN3)* C7(AIN4)* C8(AIN5)* C9(AIN6)* C12(UART0_CTSN)* C13(UART0_RTSN)* C14(SPI0_CS1)* D6(PMIC_MUX_OUT)* D7(AIN7)* D12(NC)* E2(EMU0)* E3(EMU1)* F4(VDDS_DDR)* F13(VDD_MPU)* G13(VDDS_PLL)* H6(VPP)* J6(NC)* J15(USB0_DRVVBUS)* K4(NC)* K13(USB0_CE)* L4(PMIC_NWAKEUP)* L13(USB1_CE)* M1(GPMC_ADVN_ALE)* M13(PMIC_NRESET)* M14(USB1_DRVVBUS)* N4(PMIC_LDO_PGOOD)* N10(PMIC_POWER_EN)* N11(PMIC_PWR_EN)* N13(PMIC_MUX_IN)* P2(GPMC_CSN1)* R7(GPMC_CSN3)* R16(GPMC_WPN)* T11(PMIC_PB_IN)* T12(GPMC_A0)*; U4 1(NC)*; U5 1(NC)*; U6 1(NC)*

## Notes on the sheets
sheet 1
- ECS-240-10-37-CWN-TR
- CRYSTAL 24.0000MHZ 10PF SMD
  3pF Cshunt
  0-3pF Cstray
  10pF Cload
  C1/2 = 2 * (10 - 3 - 0) = 14pF
  C1/2 = 2 * (10 - 3 - 3) = 8pF
  Minimum AM335x 12pF
- 32kHz Oscillator is used for
  RTC.  If your application
  does not use the RTC, then
  this can be removed.
- If the analog interface is not used,
  then VREFP and VREFN should be
  shorted to AGND.
- VBUS, ID, DP, and DM terminals
  may be connected to ground
- The CE pin should be left floating
- 14
- 12
- 8
- 11
- 6
- 5
- 3
- 1
- 13
- 15
- 10
- 9
- 7
- 4
- 0
- 2
- SYSBOOT
  15:14   01b     24MHz
  13:12   00b     All other reserved
  11:10   00b     Don't care for ROM code
  9       0       Don't care for ROM code
  8       0       Don't care for ROM code
  7:6     00      MII EMAC
  5       0       CLKOUT1 disabled
  4:0     11000b  Boot order: SPI0->MMC0->USB0->UART0
sheet 2
- 16MB Flash ROM
sheet 3
- UDS: D15~D8
  LDS:  D7~D0
- 1 Lower byte access
    UDS high:LDS low
  2 Higher byte access
    UDS low:LDS high
  3 Word access
    UDS low:LDS low
- The BE0n/BE1n(byte enable)
  terminal is the following.
- 1 Lower byte access
    BE0 low:BE1 high
  2 Higher byte access
    BE0 high:BE1 low
  3 In the case of word access
    BE0 low:BE1 low
- GPMC_D0 to GPMC_D7 --> M68K_D8 to M68K_D15
  GPMC_D8 to GPMC_D15 -> M68K_D0 to M68K_D7
sheet 4
- A nonportable system operates on a regulated 5-V supply that does not require input overvoltage protection.
  In this case, the 5-V power supply is connected through the BAT pins. The DC/DC converter inputs, WLED
  driver, LDO1, and LDO2 are connected directly to the 5-V supply. A standard, constant-value 10-kΩ resistor
  is connected from the TS pin to ground to simulate the NTC thermistor monitoring the battery. The load
  switches (or LDO3 and LDO4, depending on configuration) typically connect to one of the lower system rails,
  but can also be connected directly to the 5-V input supply.
- PMIC_POWER_EN	Not connected
  OSC1 hardware	Not connected
  RTC_PWRONRSTN	Pulled low
  EXT_WAKEUP	   Pulled low
  RTC_KALDO_ENN Connected to SYS_RTC_1P8V
  CAP_VDD_RTC 	 Connected to VDD_CORE
- 20mA Bright = 150R 1/8W
  10mA Power = 150R 1/8W
- LED_BRIGHT GPIO:
  HIGH: LED OFF
  HI-Z: LED HALF BRIGHT
  LOW:  LED SUPER BRIGHT
